# Altium schematic sheet Top Level.SchDoc
size A4
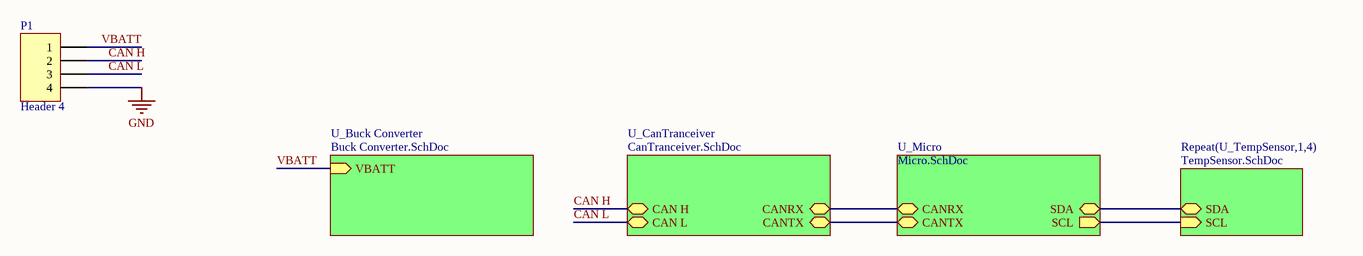
[diagram p0: Top Level.SchDoc]

## Parts
P1  Header 4  [HDR1X4]

## Sub-sheets
Repeat(U_TempSensor,1,4) = TempSensor.SchDoc: SDA (bidir), SCL (in)
U_Buck Converter = Buck Converter.SchDoc: VBATT (in)
U_CanTranceiver = CanTranceiver.SchDoc: CANTX (bidir), CANRX (bidir), CAN H (bidir), CAN L (bidir)
U_Micro = Micro.SchDoc: SDA (bidir), SCL (out), CANRX (bidir), CANTX (bidir)

## Nets
GND: P1.4
CAN H: P1.2 ; sheet U_CanTranceiver/CAN H
CAN L: P1.3 ; sheet U_CanTranceiver/CAN L
VBATT: P1.1 ; sheet U_Buck Converter/VBATT
(unnamed): sheet Repeat(U_TempSensor,1,4)/SDA, sheet U_Micro/SDA
(unnamed): sheet Repeat(U_TempSensor,1,4)/SCL, sheet U_Micro/SCL
(unnamed): sheet U_CanTranceiver/CANTX, sheet U_Micro/CANTX
(unnamed): sheet U_CanTranceiver/CANRX, sheet U_Micro/CANRX

## Library data of the parts
P1 = Header 4: Header, 4-Pin; LatestRevisionDate: 17-Jul-2002; LatestRevisionNote: Re-released for DXP Platform.; Publisher: Altium Limited